# EAGLE schematic stopwatch (EAGLE 9.6.2)
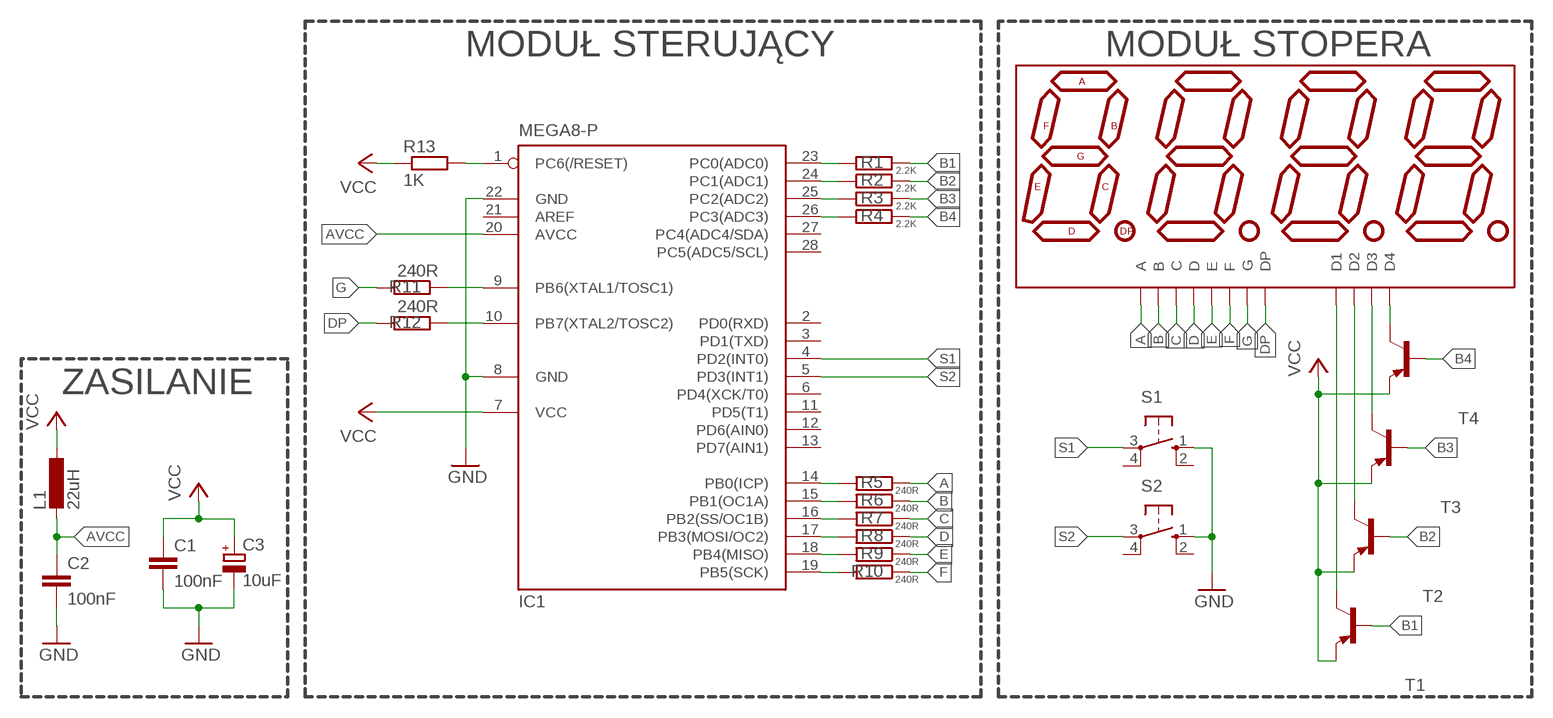
[diagram p0: schematic, sheet 1]

## Parts
C1  100nF  C-EU050-025X075  [C050-025X075]
C2  100nF  C-EU050-025X075  [C050-025X075]
C3  10uF  CPOL-EUE2,5-6E  [E2,5-6E]
DISP1  ATA8041ARBJ  7-SEGMENT-4DIGIT-20MM-RED  [7-SEGMENT-4DIGIT-20MM]
IC1  MEGA8-P  [DIL28-3]
L1  22uH  L-EU0204/7  [0204/7]
R1  2.2K  R-EU_0204/7  [0204/7]
R2  2.2K  R-EU_0204/7  [0204/7]
R3  2.2K  R-EU_0204/7  [0204/7]
R4  2.2K  R-EU_0204/7  [0204/7]
R5  240R  R-EU_0204/7  [0204/7]
R6  240R  R-EU_0204/7  [0204/7]
R7  240R  R-EU_0204/7  [0204/7]
R8  240R  R-EU_0204/7  [0204/7]
R9  240R  R-EU_0204/7  [0204/7]
R10  240R  R-EU_0204/7  [0204/7]
R11  240R  R-EU_0204/7  [0204/7]
R12  240R  R-EU_0204/7  [0204/7]
R13  1K  R-EU_0204/7  [0204/7]
S1  10-XX  [B3F-10XX]
S2  10-XX  [B3F-10XX]
T1  BC557A-PNP-TO92-EBC  [TO92-EBC]
T2  BC557A-PNP-TO92-EBC  [TO92-EBC]
T3  BC557A-PNP-TO92-EBC  [TO92-EBC]
T4  BC557A-PNP-TO92-EBC  [TO92-EBC]

## Nets
A: DISP1.11(A) R5.1
AVCC: C2.1 IC1.20(AVCC) L1.2
B: DISP1.7(B) R6.1
B1: R1.2 T1.B
B2: R2.2 T2.B
B3: R3.2 T3.B
B4: R4.2 T4.B
C: DISP1.4(C) R7.1
D: DISP1.2(D) R8.1
DP: DISP1.3(DP) R12.2
E: DISP1.1(E) R9.1
F: DISP1.10(F) R10.1
G: DISP1.5(G) R11.2
GND: C1.2 C2.2 C3.- IC1.8(GND) IC1.22(GND) S1.1(S) S2.1(S)
N$1: IC1.1(PC6(/RESET)) R13.2
N$2: IC1.14(PB0(ICP)) R5.2
N$3: IC1.23(PC0(ADC0)) R1.1
N$4: IC1.24(PC1(ADC1)) R2.1
N$5: IC1.25(PC2(ADC2)) R3.1
N$6: IC1.26(PC3(ADC3)) R4.1
N$7: IC1.9(PB6(XTAL1/TOSC1)) R11.1
N$8: IC1.10(PB7(XTAL2/TOSC2)) R12.1
N$9: IC1.15(PB1(OC1A)) R6.2
N$10: IC1.16(PB2(SS/OC1B)) R7.2
N$11: IC1.17(PB3(MOSI/OC2)) R8.2
N$12: IC1.18(PB4(MISO)) R9.2
N$13: IC1.19(PB5(SCK)) R10.2
N$23: DISP1.6(D4) T4.C
N$24: DISP1.8(D3) T3.C
N$25: DISP1.9(D2) T2.C
N$26: DISP1.12(D1) T1.C
S1: IC1.4(PD2(INT0)) S1.3(P)
S2: IC1.5(PD3(INT1)) S2.3(P)
VCC: C1.1 C3.+ IC1.7(VCC) L1.1 R13.1 T1.E T2.E T3.E T4.E
Unconnected: IC1.2(PD0(RXD)) IC1.3(PD1(TXD)) IC1.6(PD4(XCK/T0)) IC1.11(PD5(T1)) IC1.12(PD6(AIN0)) IC1.13(PD7(AIN1)) IC1.21(AREF) IC1.27(PC4(ADC4/SDA)) IC1.28(PC5(ADC5/SCL)) S1.2(S1) S1.4(P1) S2.2(S1) S2.4(P1)

## Notes on the sheet
- MODUŁ STERUJĄCY | MODUŁ STOPERA
- ZASILANIE

## Library data of the parts
C1 C2 = rcl:C-EU: CAPACITOR, European symbol; SPICEPREFIX: C
C3 = rcl:CPOL-EU: POLARIZED CAPACITOR, European symbol; SPICEPREFIX: C
DISP1 = SparkFun-LED:7-SEGMENT-4DIGIT-20MM: 4 Digit 7 Segment Display This is a part for the 4-Digit 7-segment LEDs from Young Sun. Different from the Digikey LEDs, all 16 pins are used. The LONGPADS Variant is used for a test jig, but you may like it because there is more pad to solder to. If you are concerned about routing space, the standard works just fine though. Datasheets: Red <http://cdn.sparkfun.com/datasheets/Components/LED/1LEDREDCC.pdf> Yellow <http://cdn.sparkfun.com/datasheets/Components/LED/1LEDYELCC.pdf> Green <http://cdn.sparkfun.com/datasheets/Components/LED/1LEDGRNCC.pdf> Blue <http://cdn.sparkfun.com/datasheets/Components/LED/1LEDBLUCC.pdf> White <http://cdn.sparkfun.com/datasheets/Components/LED/1LEDWHTCC.pdf> SparkFun Products Raw Components 7-Segment Display - 20mm (Red) <https://www.sparkfun.com/products/11405> (COM-11405) 7-Segment Display - 20mm (Yellow) <https://www.sparkfun.com/products/11406> (COM-11406) 7-Segment Display - 20mm (Green) <https://www.sparkfun.com/products/11407> (COM-11407) 7-Segment Display - 20mm (Blue) <https://www.sparkfun.com/products/11408> (COM-11408) 7-Segment Display - 20mm (White) <https://www.sparkfun.com/products/11409> (COM-11409) Serial Controlled SparkFun OpenSegment Serial Display - 20mm (Red) <https://www.sparkfun.com/products/11644> (COM-11644) SparkFun OpenSegment Serial Display - 20mm (Yellow) <https://www.sparkfun.com/products/11645> (COM-11645) SparkFun OpenSegment Serial Display - 20mm (Green) <https://www.sparkfun.com/products/11646> (COM-11646) SparkFun OpenSegment Serial Display - 20mm (Blue) <https://www.sparkfun.com/products/11647> (COM-11647) SparkFun OpenSegment Serial Display - 20mm (White) <https://www.sparkfun.com/products/11648> (COM-11648) Other SparkFun OpenSegment Shield <https://www.sparkfun.com/products/13190> (DEV-13190); PROD_ID: COMP-11449
IC1 = atmel:MEGA8-P: MICROCONTROLLER 8 Kbytes FLASH, 1 kbytes SRAM, 512 bytes EEPROM, USART, 4-channel 10 bit ADC, 2-channel 8 bit ADC Pin compatible with Atmega48, ATMega88, ATMega168 Source: avr.lbr; OC_FARNELL: unknown; OC_NEWARK: unknown
L1 = rcl:L-EU: INDUCTOR, European symbol; SPICEPREFIX: L
R1-R13 = rcl:R-EU_: RESISTOR, European symbol; SPICEPREFIX: R
S1 S2 = switch-omron:10-XX: OMRON SWITCH; MPN: B3F-1000; OC_FARNELL: 176432; OC_NEWARK: 36M3542
T1-T4 = transistor:*-PNP-: PNP Transistror